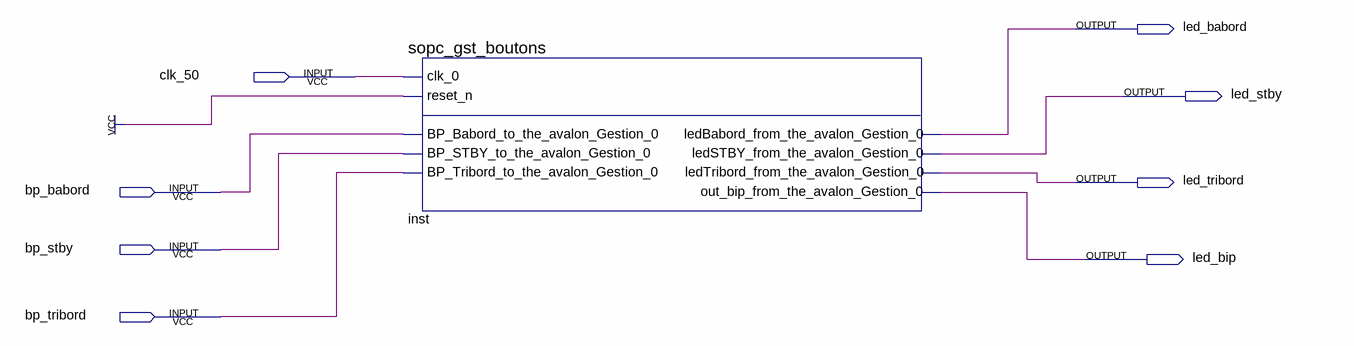
[diagram p0: schematic sheet]
// Quartus schematic sopc_gestion_bouton.bdf as structural Verilog: 1 symbols, 8 pins
module sopc_gestion_bouton (
  input  clk_50,
  input  bp_babord,
  input  bp_stby,
  input  bp_tribord,
  output led_babord,
  output led_stby,
  output led_tribord,
  output led_bip
);

  sopc_gst_boutons inst (
    .clk_0(clk_50), .reset_n(1'b1), .BP_Babord_to_the_avalon_Gestion_0(bp_babord),
    .BP_STBY_to_the_avalon_Gestion_0(bp_stby), .BP_Tribord_to_the_avalon_Gestion_0(bp_tribord),
    .ledBabord_from_the_avalon_Gestion_0(led_babord), .ledSTBY_from_the_avalon_Gestion_0(led_stby),
    .ledTribord_from_the_avalon_Gestion_0(led_tribord), .out_bip_from_the_avalon_Gestion_0(led_bip));
endmodule
